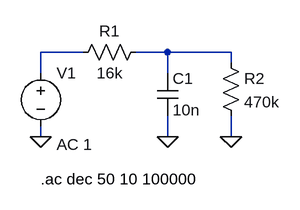
[diagram p0: schematic lpf_0_1.asc]
lpf_0_1.asc, the LTspice schematic file:
Version 4
SHEET 1 880 680
WIRE 64 80 0 80
WIRE 192 80 144 80
WIRE 288 80 192 80
WIRE 288 96 288 80
WIRE 0 112 0 80
WIRE 192 112 192 80
WIRE 0 208 0 192
WIRE 192 208 192 176
WIRE 288 208 288 176
FLAG 192 208 0
FLAG 0 208 0
FLAG 288 208 0
SYMBOL res 160 64 R90
WINDOW 0 0 56 VBottom 2
WINDOW 3 32 56 VTop 2
SYMATTR InstName R1
SYMATTR Value 16k
SYMBOL cap 176 112 R0
SYMATTR InstName C1
SYMATTR Value 10n
SYMBOL voltage 0 96 R0
WINDOW 123 24 124 Left 2
WINDOW 39 0 0 Left 2
SYMATTR InstName V1
SYMATTR Value ""
SYMATTR Value2 AC 1
SYMBOL res 272 80 R0
SYMATTR InstName R2
SYMATTR Value 470k
TEXT 0 272 Left 2 !.ac dec 50 10 100000

The netlist it stands for:
* lpf_0_1.asc
R1 N002 N001 16k
C1 N002 0 10n
V1 N001 0 AC 1
R2 N002 0 470k
.ac dec 50 10 100000
.backanno
.end